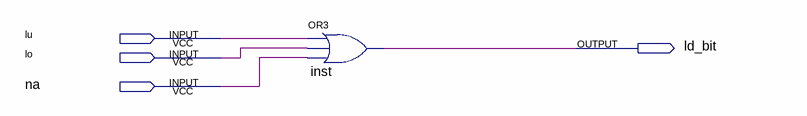
[diagram p0: schematic sheet]
// Quartus schematic load_fft.bdf as structural Verilog: 1 symbols, 4 pins
module load_fft (
  input  lu,
  input  lo,
  input  na,
  output ld_bit
);

  or inst (ld_bit, lu, lo, na);
endmodule
